# EAGLE design Microbrute Output Board (EAGLE 7.6.0)
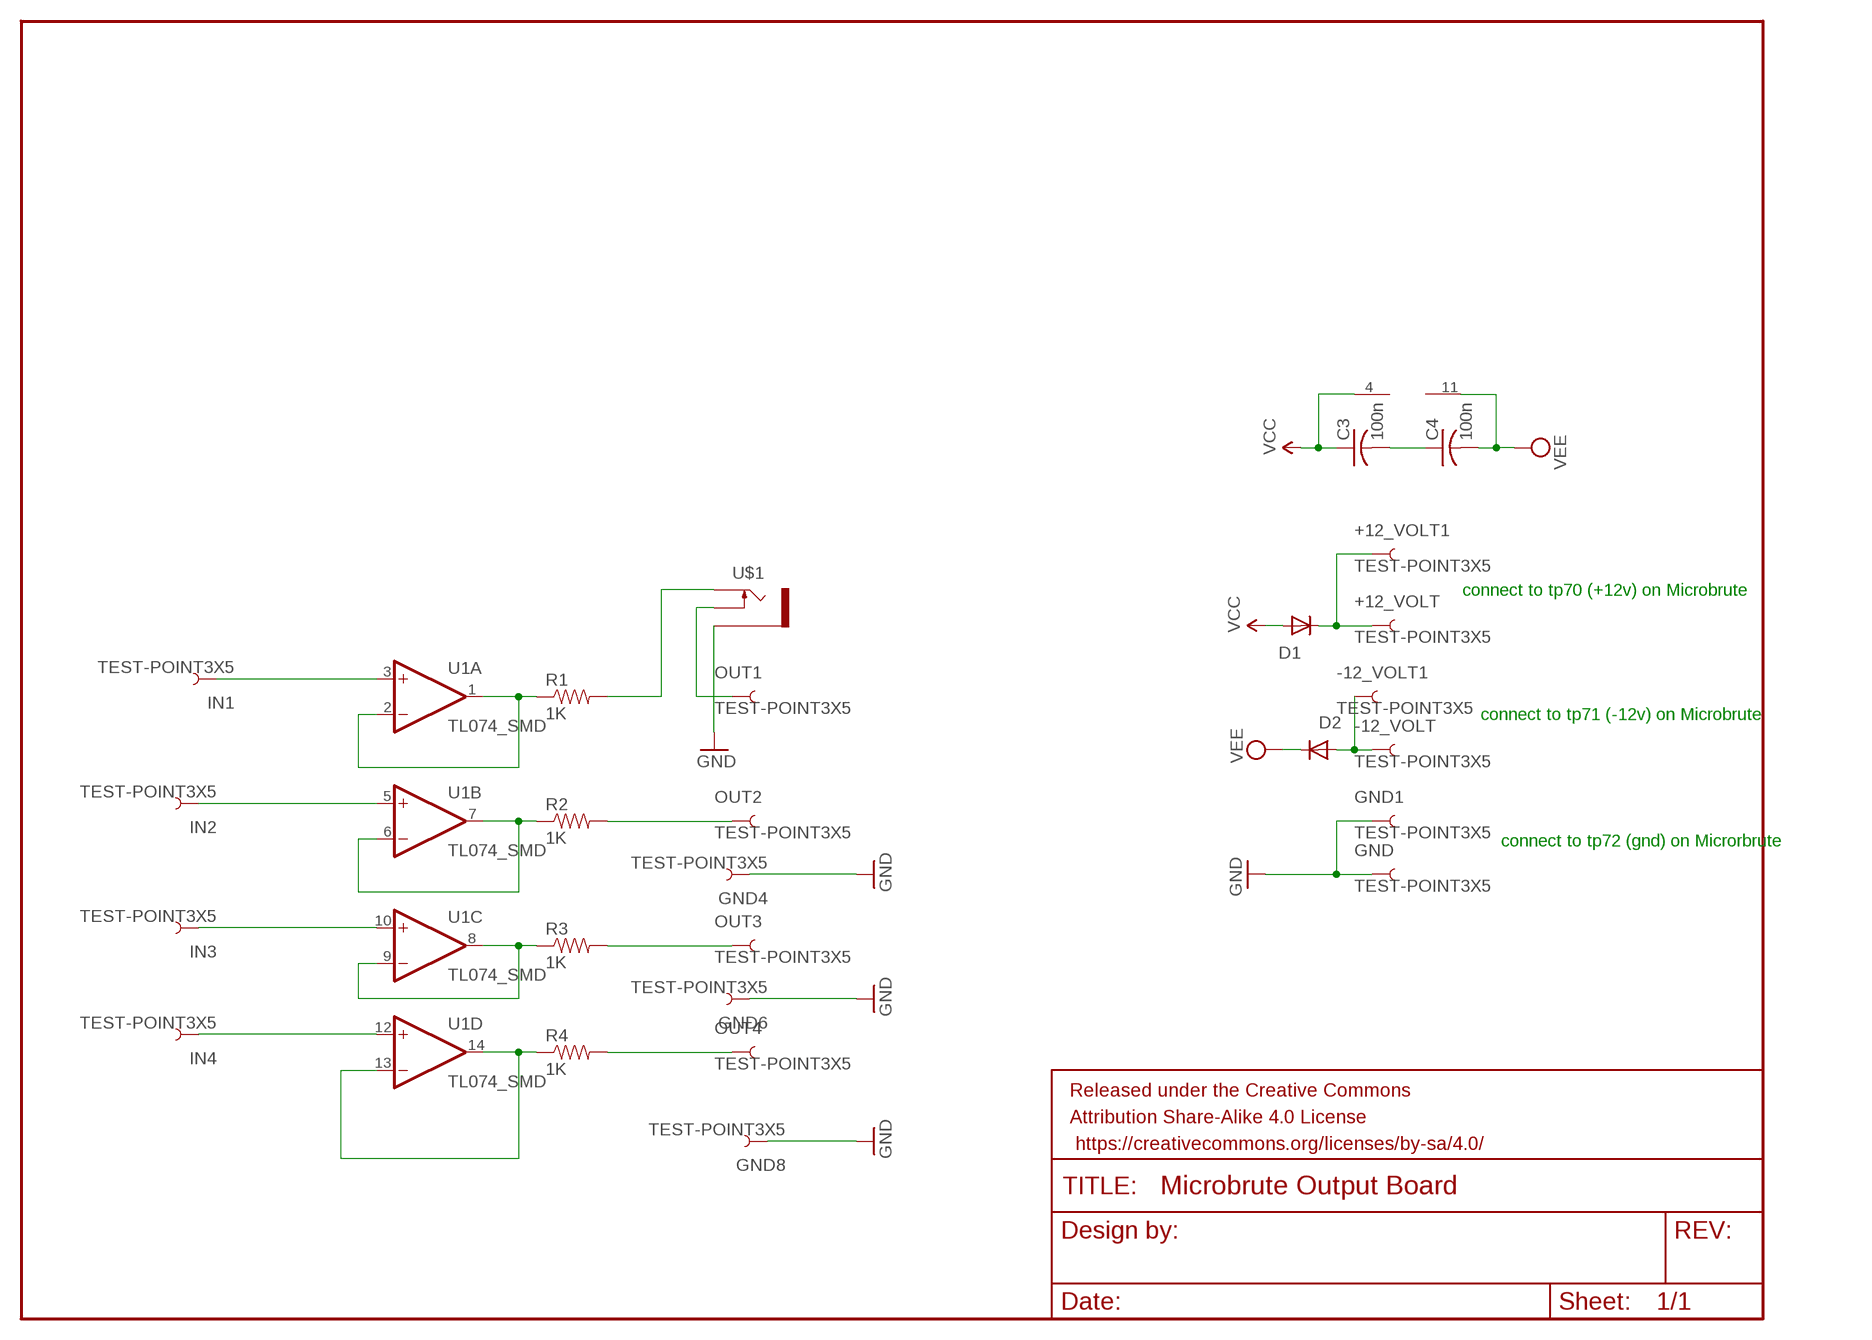
[diagram p0: schematic, sheet 1]

## Parts
+12_VOLT  TEST-POINT3X5  [PAD.03X.05]
+12_VOLT1  TEST-POINT3X5  [PAD.03X.05]
-12_VOLT  TEST-POINT3X5  [PAD.03X.05]
-12_VOLT1  TEST-POINT3X5  [PAD.03X.05]
C3  100n  C-USC0603  [C0603]
C4  100n  C-USC0603  [C0603]
D1  1N5819HW  DIODE-SOD123  [SOD123]
D2  1N5819HW  DIODE-SOD123  [SOD123]
FRAME1  FRAME-LETTER  [CREATIVE_COMMONS]
GND  TEST-POINT3X5  [PAD.03X.05]
GND1  TEST-POINT3X5  [PAD.03X.05]
GND4  TEST-POINT3X5  [PAD.03X.05]
GND6  TEST-POINT3X5  [PAD.03X.05]
GND8  TEST-POINT3X5  [PAD.03X.05]
IN1  TEST-POINT3X5  [PAD.03X.05]
IN2  TEST-POINT3X5  [PAD.03X.05]
IN3  TEST-POINT3X5  [PAD.03X.05]
IN4  TEST-POINT3X5  [PAD.03X.05]
OUT1  TEST-POINT3X5  [PAD.03X.05]
OUT2  TEST-POINT3X5  [PAD.03X.05]
OUT3  TEST-POINT3X5  [PAD.03X.05]
OUT4  TEST-POINT3X5  [PAD.03X.05]
R1  1K  1KOHM-1/10W-1%(0603)  [0603-RES]
R2  1K  1KOHM-1/10W-1%(0603)  [0603-RES]
R3  1K  1KOHM-1/10W-1%(0603)  [0603-RES]
R4  1K  1KOHM-1/10W-1%(0603)  [0603-RES]
U1  TL074_SMD  [SO14]
U$1  THONKICONNNEW  [WQP-PJ301M-12_JACK]

## Nets
GND: GND1.P$1 GND4.P$1 GND6.P$1 GND8.P$1 GND.P$1 U$1.P$3_SLEEVE(SLEEVE)
GND1: C3.2 C4.1
N$1: +12_VOLT1.P$1 +12_VOLT.P$1 D1.C
N$2: -12_VOLT1.P$1 -12_VOLT.P$1 D2.A
N$3: R1.2 U$1.P$1_TIP(TIP)
N$4: OUT1.P$1 U$1.P$2_SWITCH(SWITCH)
N$5: OUT2.P$1 R2.2
N$6: R3.1 U1.8(C:OUT) U1.9(C:-IN)
N$7: OUT4.P$1 R4.2
N$8: R1.1 U1.1(A:OUT) U1.2(A:-IN)
N$9: R2.1 U1.6(B:-IN) U1.7(B:OUT)
N$10: OUT3.P$1 R3.2
N$11: R4.1 U1.13(D:-IN) U1.14(D:OUT)
N$12: IN2.P$1 U1.5(B:+IN)
N$13: IN3.P$1 U1.10(C:+IN)
N$14: IN4.P$1 U1.12(D:+IN)
N$15: IN1.P$1 U1.3(A:+IN)
VCC: C3.1 D1.A U1.4(P:V+)
VEE: C4.2 D2.C U1.11(P:V-)

## Notes on the sheet
- connect to tp70 (+12v) on Microbrute
- connect to tp71 (-12v) on Microbrute
- connect to tp72 (gnd) on Microrbrute

## Library data of the parts
+12_VOLT +12_VOLT1 -12_VOLT -12_VOLT1 GND GND1 GND4 GND6 GND8 IN1-IN4 OUT1-OUT4 = SparkFun-Passives:TEST-POINT: Bare copper test points for troubleshooting or ICT
C3 C4 = rcl:C-US: CAPACITOR, American symbol
D1 D2 = diode:DIODE-: DIODE
FRAME1 = SparkFun-Aesthetics:FRAME-LETTER: Schematic Frame Standard 8.5x11 US Letter frame
R1-R4 = SparkFun-Resistors:1KOHM-1/10W-1%(0603): RES-07856; PROD_ID: RES-07856
U1 = MusicThingModular:TL074: Generic Quad Op Amp
U$1 = MusicThingModular:THONKICONN: 3.5mm socket for Eurorack modular synths

## Board
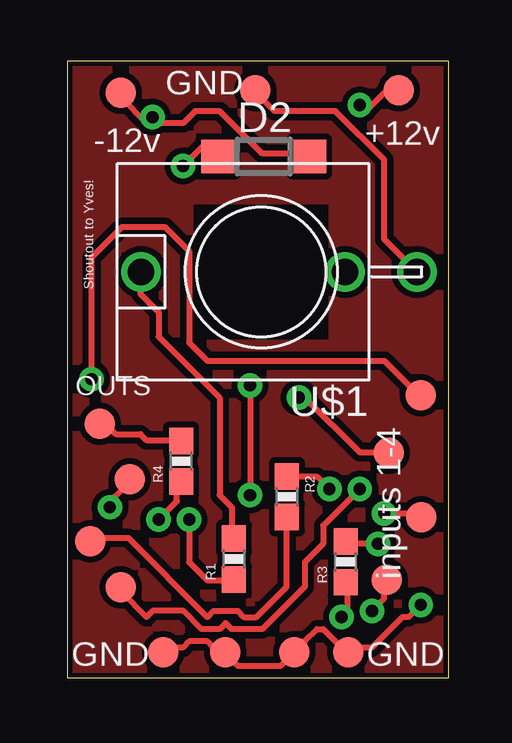
[diagram p1: board, top side]
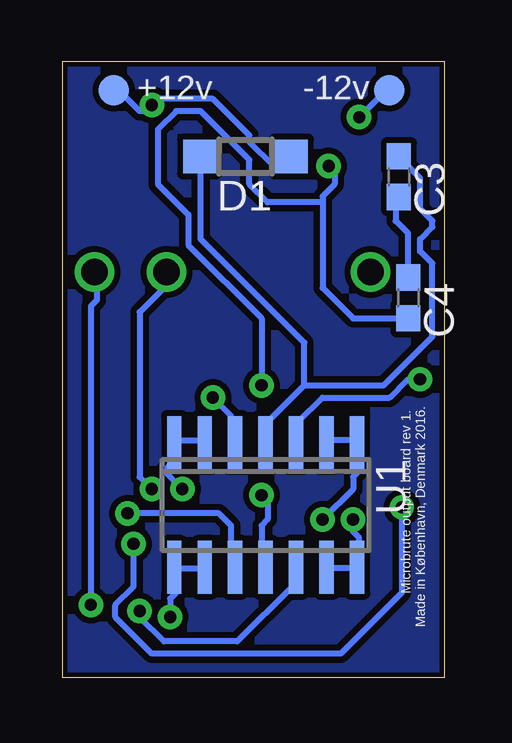
[diagram p2: board, bottom side, seen from below]

Size 15.9 x 25.7 mm. Coordinates in mm from the lower left corner, seen from the top.
Outline: 0,0 15.9,0 15.9,25.7 0,25.7 0,0
Copper layers (1*16): Top 0.035mm / dielectric 1.5mm / Bottom 0.035mm
Design rules "SparkFun-2-layer-STANDARD": minimum track width 10mil, minimum drill 20mil, track to track 10mil, track to pad 8mil, pad to pad 8mil, via to via 10mil, smd to smd 8mil, copper to edge 8mil, drill to drill 8mil, minimum pad ring 10mil, minimum via ring 10mil, stop-mask expansion 4mil, vias tented up to drill 25mil, thermal gap 10mil

### Footprints (pad centres in the part's own frame; a part is rotated, then mirrored left to right if it is on the bottom)
PAD.03X.05 = smd 1.27 x 1.27: P$1 0,0
C0603 = smd 1.1 x 1: 1 -0.85,0; 2 0.85,0
SOD123 = smd 1.4 x 1.4: A 1.9,0; C -1.9,0
0603-RES = smd 1.1 x 1: 1 -0.85,0; 2 0.85,0
SO14 = smd 0.6 x 2.2: 1 -3.81,-2.6; 2 -2.54,-2.6; 3 -1.27,-2.6; 4 0,-2.6; 5 1.27,-2.6; 6 2.54,-2.6; 7 3.81,-2.6; 8 3.81,2.6; 9 2.54,2.6; 10 1.27,2.6; 11 0,2.6; 12 -1.27,2.6; 13 -2.54,2.6; 14 -3.81,2.6
WQP-PJ301M-12_JACK = drill 1.1: P$1_TIP 0,5; P$2_SWITCH 0,-3.5; P$3_SLEEVE 0,-6.5

### Placement (x,y rotation side)
+12_VOLT  13.82,24.48 0 top
+12_VOLT1  13.78,24.48 0 bottom
-12_VOLT  2.24,24.38 0 top
-12_VOLT1  2.3,24.48 0 bottom
C3  1.9,20.89 270 bottom
C4  1.5,15.84 270 bottom
D1  8.29,21.73 180 bottom
D2  8.19,21.73 0 top
FRAME1  -101.6,15.24 0 top  (outside the outline)
GND  9.46,1.08 0 top
GND1  11.72,1.08 0 top
GND4  6.58,1.08 0 top
GND6  7.84,24.48 0 top
GND8  4,1.08 0 top
IN1  14.73,11.79 0 top
IN2  13.39,9.39 0 top
IN3  14.75,6.69 0 top
IN4  13.31,4.09 0 top
OUT1  2.23,3.79 0 top
OUT2  0.97,5.69 0 top
OUT3  2.61,8.29 0 top
OUT4  1.35,10.59 0 top
R1  6.95,4.96 90 top
R2  9.15,7.55 270 top
R3  11.6,4.84 90 top
R4  4.75,9.03 90 top
U1  7.45,7.21 180 bottom
U$1  8.08,16.92 90 top

### Tracks (layer width: path | path; a pad name or v marks a point on that pad's centre or on a via)
GND  (via drill 0.51)
  Top 0.254: 6.6,1.02 6.35,0.76 6.1,1.02 6.1,1.27 5.84,1.52 5.08,1.52 4.83,1.27 4.06,1.27 GND8.P$1 | 6.6,1.02 7.11,0.51 8.89,0.51 9.4,1.02 GND.P$1 9.4,1.27 9.4,1.52 9.91,1.52 10.41,2.03 10.67,2.03 11.43,1.27 11.68,1.27 GND1.P$1 11.94,1.27 12.7,1.27 13.97,2.54 14.22,2.54 v14.73,3.05 | 6.6,1.02 GND4.P$1 | GND6.P$1 7.87,24.38 8.64,23.62 11.18,23.62 13.21,21.59 13.21,18.29 14.48,17.02 U$1.P$3_SLEEVE
  Bottom 0.254: v14.73,3.05 14.73,15.49 14.48,15.75 14.48,16.76 U$1.P$3_SLEEVE
GND1
  Bottom 0.254: C4.1 1.52,16.76 1.52,18.54 2.03,19.05 2.03,19.81 C3.2
N$1  (via drill 0.51)
  Top 0.254: v12.19,23.88 12.45,23.62 13.21,24.38 13.72,24.38 +12_VOLT.P$1
  Bottom 0.254: +12_VOLT1.P$1 13.72,24.38 13.46,24.38 12.7,23.62 12.45,23.62 v12.19,23.88 11.94,24.13 9.65,24.13 8.13,22.61 8.13,22.35 7.11,21.34 6.86,21.34 6.6,21.59 D1.C
N$2  (via drill 0.51)
  Top 0.254: 3.56,23.11 4.83,23.11 5.33,23.62 6.35,23.62 8.13,21.84 9.91,21.84 D2.A | 3.56,23.11 3.3,23.11 2.29,24.13 -12_VOLT.P$1 | 3.56,23.11 v3.56,23.37
  Bottom 0.254: v3.56,23.37 2.54,24.38 -12_VOLT1.P$1
N$3
  Top 0.254: R1.2 6.86,5.84 6.86,7.11 6.35,7.62 6.35,11.68 3.81,14.22 3.81,15.24 3.05,16 3.05,16.76 U$1.P$1_TIP
N$4  (via drill 0.51)
  Top 0.254: v12.19,7.87 10.67,6.35 10.67,5.59 9.91,4.83 9.91,3.81 8.13,2.03 6.86,2.03 6.6,2.29 6.35,2.03 5.59,2.03 4.83,2.79 3.56,2.79 3.3,2.54 2.29,3.56 OUT1.P$1
  Bottom 0.254: v12.19,7.87 12.7,8.38 12.7,15.24 11.68,16.26 11.68,16.76 U$1.P$2_SWITCH
N$5
  Top 0.254: R2.2 9.14,6.6 9.14,3.81 7.87,2.54 7.37,2.54 7.11,2.79 6.1,2.79 5.84,2.54 2.54,5.84 1.02,5.84 OUT2.P$1
N$6  (via drill 0.51)
  Top 0.254: v11.43,2.54 11.68,2.79 11.68,3.81 R3.1
  Bottom 0.254: v11.43,2.54 11.43,3.3 11.18,3.56 11.18,4.57 | 11.18,4.57 10.16,4.57 U1.9 | 11.18,4.57 U1.8
N$7
  Top 0.254: R4.2 4.57,9.91 3.3,9.91 3.05,10.16 2.03,10.16 1.78,10.41 1.78,10.67 1.52,10.67 OUT4.P$1
N$8  (via drill 0.51)
  Top 0.254: v5.08,6.6 5.08,4.83 5.84,4.06 6.86,4.06 R1.1
  Bottom 0.254: v5.08,6.6 3.81,7.87 3.81,8.38 3.56,8.64 3.56,9.65 U1.1 3.81,9.91 4.83,9.91 U1.2
N$9  (via drill 0.51)
  Top 0.254: v10.92,7.87 10.41,8.38 9.4,8.38 R2.1
  Bottom 0.254: v10.92,7.87 11.68,8.64 11.18,9.14 11.18,9.65 U1.7 11.18,9.91 10.16,9.91 U1.6
N$10  (via drill 0.51)
  Top 0.254: v12.95,5.59 11.68,5.59 R3.2 | v1.78,7.11 1.78,7.37 2.29,7.87 2.29,8.13 2.54,8.38 OUT3.P$1
  Bottom 0.254: v12.95,5.59 12.95,3.81 13.72,3.05 13.72,2.54 12.19,1.02 4.32,1.02 1.78,3.56 v1.78,7.11
N$11  (via drill 0.51)
  Top 0.254: v3.81,6.6 4.57,7.37 4.57,8.13 R4.1
  Bottom 0.254: v3.81,6.6 3.81,6.1 3.56,5.84 3.56,4.83 U1.14 3.81,4.57 4.83,4.57 U1.13
N$12  (via drill 0.51)
  Top 0.254: v9.65,11.68 9.91,11.68 12.19,9.4 13.21,9.4 IN2.P$1
  Bottom 0.254: v9.65,11.68 8.89,10.92 8.89,9.91 U1.5
N$13  (via drill 0.51)
  Top 0.254: v13.21,6.86 14.73,6.86 IN3.P$1
  Bottom 0.254: v13.21,6.86 9.4,6.86 8.89,6.35 8.89,4.83 U1.10
N$14  (via drill 0.51)
  Top 0.254: v12.7,2.79 13.21,3.3 13.21,4.06 IN4.P$1
  Bottom 0.254: v12.7,2.79 12.7,2.54 11.68,1.52 8.64,1.52 6.35,3.81 6.35,4.57 U1.12
N$15  (via drill 0.51)
  Top 0.254: v1.02,12.45 1.02,17.53 2.29,18.8 4.06,18.8 5.08,17.78 5.08,13.97 5.84,13.21 13.21,13.21 14.48,11.94 IN1.P$1
  Bottom 0.254: v1.02,12.45 1.52,12.45 2.29,11.68 5.08,11.68 6.1,10.67 6.1,9.91 U1.3
N$16
  pour Top: -0.2,-0.1 15.9,0 15.9,25.6 0,25.6
N$17
  pour Bottom: 0.1,25.6 15.9,25.6 15.9,-0.1 0.1,-0.1
VCC
  Bottom 0.254: 5.84,12.19 2.54,12.19 0.51,14.22 0.51,17.27 1.02,17.78 1.02,18.29 0.51,18.8 0.51,19.05 1.02,19.56 1.02,20.83 1.78,21.59 C3.1 | 5.84,12.19 7.37,10.67 7.37,9.91 U1.4 | 5.84,12.19 5.84,13.97 10.16,18.29 10.16,21.59 D1.A
VEE  (via drill 0.51)
  Top 0.254: v4.83,21.34 5.59,22.1 5.84,22.1 6.1,21.84 D2.C | v7.62,12.19 v7.62,7.62
  Bottom 0.254: 5.08,19.81 5.08,20.07 4.57,20.57 4.57,21.08 v4.83,21.34 | 5.08,19.81 5.08,16.26 3.81,14.99 1.52,14.99 C4.2 | v7.62,7.62 7.37,7.37 7.37,6.6 7.62,6.35 7.62,4.83 U1.11 | v7.62,12.19 7.62,14.99 10.67,18.03 10.67,19.3 11.94,20.57 11.94,22.86 11.18,23.62 10.16,23.62 8.13,21.59 8.13,20.57 7.37,19.81 5.08,19.81

### Text on the board
tNames: GND | -12v | +12v | Shoutout to Yves! | OUTS | inputs 1-4 | GND | GND
bNames: -12v | +12v | Microbrute output board rev 1. / Made in København, Denmark 2016.